# EAGLE design RTC-power (EAGLE 7.6.0)
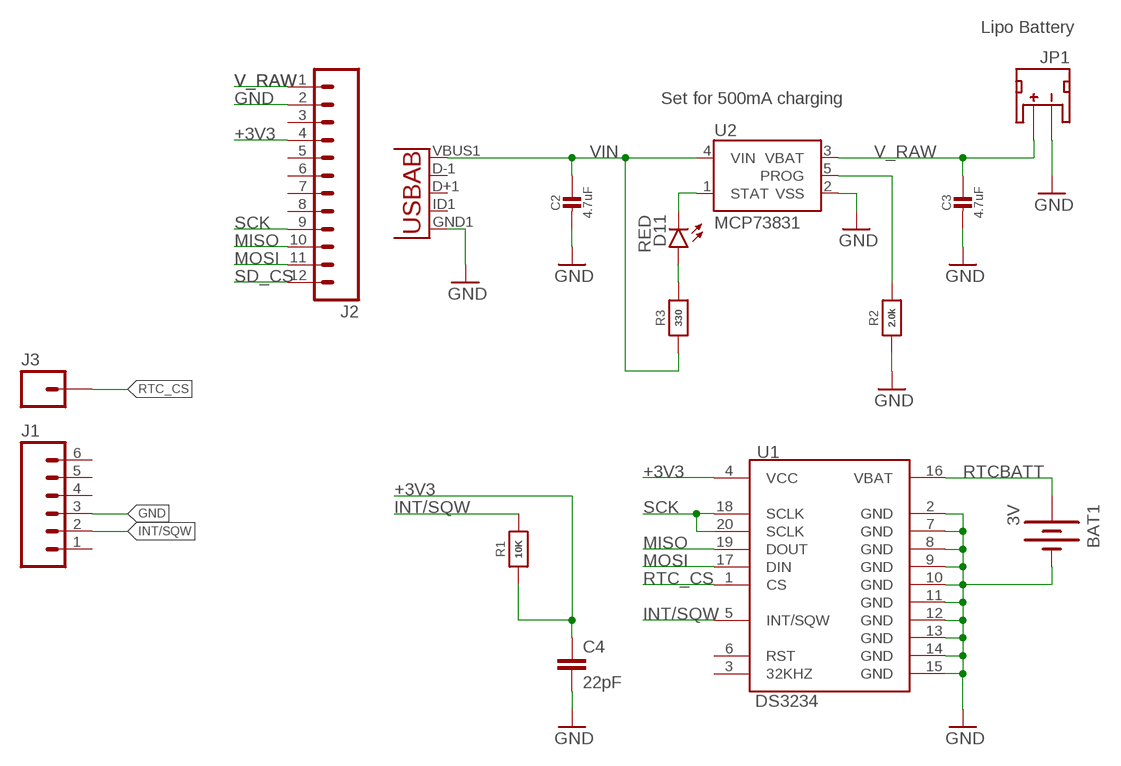
[diagram p0: schematic, sheet 1]

## Parts
BAT1  3V  BATTERY  [BATTCON_12MM_CURVED]
C2  4.7uF  CAP_CERAMIC0805-NOOUTLINE  [0805-NO]
C3  4.7uF  CAP_CERAMIC0805-NOOUTLINE  [0805-NO]
C4  22pF  CAP0402-CAP  [0402-CAP]
D11  RED  LED-RED0603  [LED-0603]
J1  M06SILK_FEMALE_PTH  [1X06]
J2  M12PTH  [1X12]
J3  M01PTH  [1X01]
JP1  JST  JST_2MM_MALE  [JST-2-SMD@1]
JP9  Micro USB  USB-ABCONN-11794  [USB-AB-MICRO-SMD_V03]
R1  10K  RESISTOR_0805MP  [_0805MP]
R2  2.0k  RESISTOR_0805MP  [_0805MP]
R3  330  RESISTOR_0805MP  [_0805MP]
U1  DS3234  [DS3234]
U2  MCP73831  [SOT23-5]

## Nets
+3V3: C4.1 J2.4 R1.1 U1.4(VCC)
GND: BAT1.GND(-) C2.2 C3.2 C4.2 J2.2 JP1.1(-) JP9.GND1(GND) R2.1 U1.2(GND) U1.7(GND) U1.8(GND) U1.9(GND) U1.10(GND) U1.11(GND) U1.12(GND) U1.13(GND) U1.14(GND) U1.15(GND) U2.2(VSS)
INT/SQW: R1.2 U1.5(INT/SQW)
MISO: J2.10 U1.19(DOUT)
MOSI: J2.11 U1.17(DIN)
N$3: D11.A R3.2
PROG: R2.2 U2.5(PROG)
RTC_CS: J3.1 U1.1(CS)
RTCBATT: BAT1.PWR@1(+) U1.16(VBAT)
SCK: J2.9 U1.18(SCLK) U1.20(SCLK)
SD_CS: J2.12
STAT: D11.C U2.1(STAT)
V_RAW: C3.1 J2.1 JP1.2(+) U2.3(VBAT)
VIN: C2.1 JP9.VBUS1(VBUS) R3.1 U2.4(VIN)
Unconnected: J1.1 J1.2 J1.3 J1.4 J1.5 J1.6 J2.3 J2.5 J2.6 J2.7 J2.8 JP1.NC1(PAD1) JP1.NC2(PAD2) JP9.D+1(D+) JP9.D-1(D-) JP9.ID1(USBID) U1.3(32KHZ) U1.6(RST)

## Notes on the sheet
- Lipo Battery
- Set for 500mA charging

## Library data of the parts
BAT1 = SparkFun:BATTERY: Battery Holders Various common sizes : AA, AAA, 20mm coin cell and 12mm coin cell.
C2 C3 = microbuilder:CAP_CERAMIC: Ceramic Capacitors For new designs, use the packages preceded by an '_' character since they are more reliable: The following footprints should be used on most boards: _0402 - Standard footprint for regular board layouts _0603 - Standard footprint for regular board layouts _0805 - Standard footprint for regular board layouts _1206 - Standard footprint for regular board layouts For extremely tight-pitch boards where space is at a premium, the following 'micro-pitch' footprints can be used (smaller pads, no silkscreen outline, etc.): _0402MP - Micro-pitch footprint for very dense/compact boards _0603MP - Micro-pitch footprint for very dense/compact boards _0805MP - Micro-pitch footprint for very dense/compact boards _1206MP - Micro-pitch footprint for very dense/compact boards
C4 = SparkFun:CAP: Capacitor Standard 0603 ceramic capacitor, and 0.1" leaded capacitor.
D11 = SparkFun-LED:LED-RED: Assorted Red LEDs LilyPad 1206- DIO-09912 1206- DIO-00809 0603- DIO-00819; PROD_ID: DIO-00819
J1 = SparkFun-Connectors:M06: Header 6 Standard 6-pin 0.1" header. Use with straight break away headers (SKU : PRT-00116), right angle break away headers (PRT-00553), swiss pins (PRT-00743), machine pins (PRT-00117), and female headers (PRT-00115). Molex polarized connector foot print use with SKU : PRT-08094 with associated crimp pins and housings. NOTES ON THE VARIANTS LOCK and LOCK_LONGPADS... This footprint was designed to help hold the alignment of a through-hole component (i.e. 6-pin header) while soldering it into place. You may notice that each hole has been shifted either up or down by 0.005 of an inch from it's more standard position (which is a perfectly straight line). This slight alteration caused the pins (the squares in the middle) to touch the edges of the holes. Because they are alternating, it causes a "brace" to hold the component in place. 0.005 has proven to be the perfect amount of "off-center" position when using our standard breakaway headers. Although looks a little odd when you look at the bare footprint, once you have a header in there, the alteration is very hard to notice. Also,if you push a header all the way into place, it is covered up entirely on the bottom side. This idea of altering the position of holes to aid alignment will be further integrated into the Sparkfun Library for other footprints. It can help hold any component with 3 or more connection pins.; PROD_ID: CONN-08437
J2 = SparkFun-Connectors:M12: Header 12 Standard 12-pin 0.1" header. Use with straight break away headers (SKU : PRT-00116), right angle break away headers (PRT-00553), swiss pins (PRT-00743), machine pins (PRT-00117), and female headers (PRT-00115).
J3 = SparkFun-Connectors:M01: Header 1 Standard 1-pin 0.1" header. Use with straight break away headers (SKU : PRT-00116), right angle break away headers (PRT-00553), swiss pins (PRT-00743), machine pins (PRT-00117), and female headers (PRT-00115). SMTSO-256-ET is a "flush mount" nut for a 4-40 screw. The older package used to be too tight, and did not allow it to sit properly thru the drill hit. The latest (0.165DIA) fits nice and snug.
JP1 = SparkFun-Connectors:JST_2MM_MALE: Mates to single-cell LiPo batteries. CONN-08352; PROD_ID: CONN-08352
JP9 = SparkFun-Connectors:USB-AB: This is a USB AB connector that is compatible with USB OTG. i.e. this connector can serve as a host or device; PROD_ID: CONN-11794
R1-R3 = microbuilder:RESISTOR: Resistors For new designs, use the packages preceded by an '_' character since they are more reliable: The following footprints should be used on most boards: _0402 - Standard footprint for regular board layouts _0603 - Standard footprint for regular board layouts _0805 - Standard footprint for regular board layouts _1206 - Standard footprint for regular board layouts For extremely tight-pitch boards where space is at a premium, the following 'micro-pitch' footprints can be used (smaller pads, no silkscreen outline, etc.): _0402MP - Micro-pitch footprint for very dense/compact boards _0603MP - Micro-pitch footprint for very dense/compact boards _0805MP - Micro-pitch footprint for very dense/compact boards _1206MP - Micro-pitch footprint for very dense/compact boards
U1 = SparkFun:DS3234: DS3234 Real Time Clock
U2 = SparkFun-PowerIC:MCP73831: Miniature single cell, fully integrated Li-Ion, Li-polymer charge management controller http://ww1.microchip.com/downloads/en/DeviceDoc/21984a.pdf IC-09995; PROD_ID: IC-09995

## Board
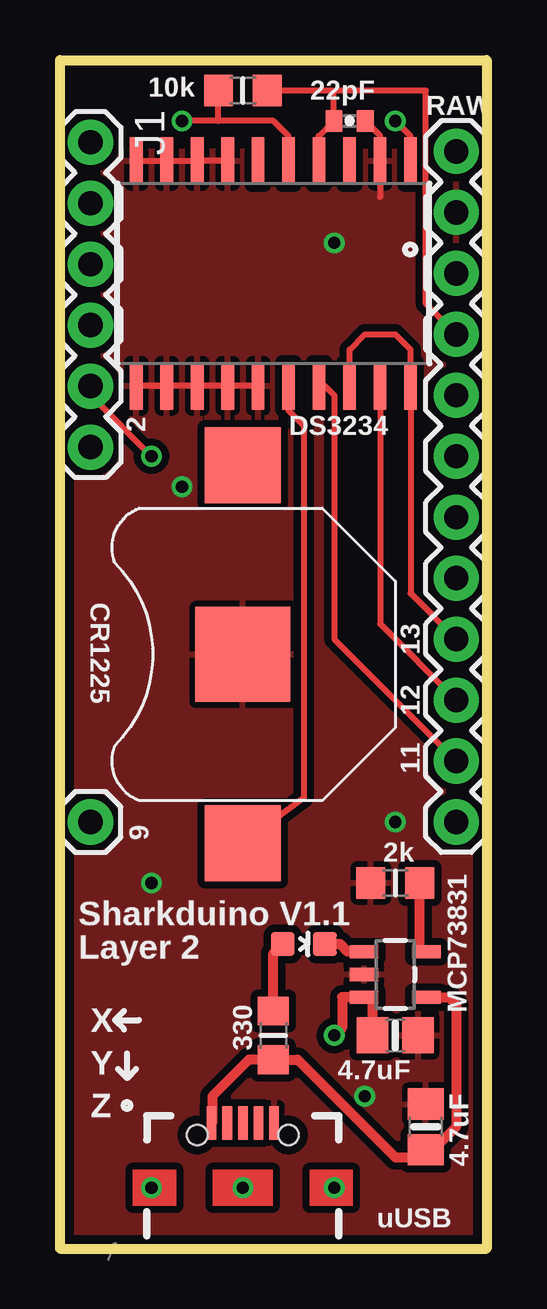
[diagram p1: board, top side]
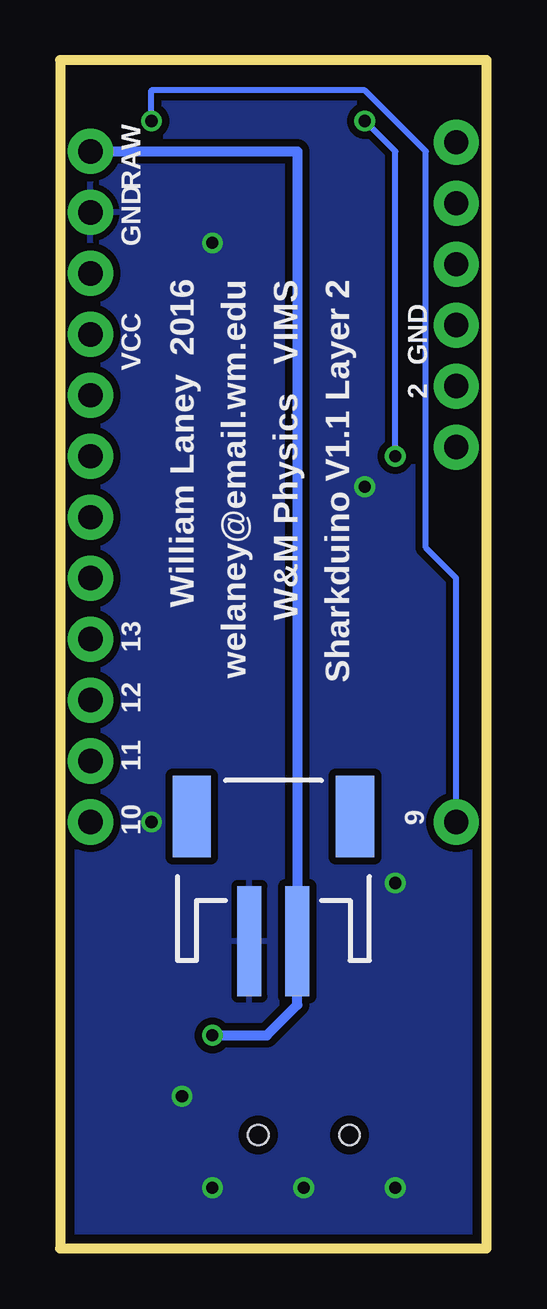
[diagram p2: board, bottom side, seen from below]

Size 17.78 x 49.53 mm. Coordinates in mm from the lower left corner, seen from the top.
Outline: 0,0 0,49.53 17.78,49.53 17.78,0 0,0
Copper layers (1*16): Top 0.0356mm / dielectric 1.5011mm / Bottom 0.0356mm
Design rules "oshpark-2layer": minimum track width 6mil, minimum drill 13mil, track to track 6mil, track to pad 6mil, pad to pad 6mil, via to via 6mil, smd to smd 6mil, copper to edge 15mil, drill to drill 6mil, minimum pad ring 7mil, minimum via ring 7mil, stop-mask expansion 2.5mil, vias tented up to drill 0mil, thermal gap 10mil

### Footprints (pad centres in the part's own frame; a part is rotated, then mirrored left to right if it is on the bottom)
BATTCON_12MM_CURVED = smd 3.962 x 3.962: GND 0,0 | smd 3.175 x 3.175: PWR@1 -7.874,0; PWR@2 7.874,0
0805-NO = smd 1.3 x 1.5: 1 -0.95,0; 2 0.95,0
0402-CAP = smd 0.7 x 0.9: 1 -0.65,0; 2 0.65,0
LED-0603 = smd 1 x 1: A 0,-0.877; C 0,0.877
1X06 = drill 1.016 pad 1.88: 1 0,0; 2 2.54,0; 3 5.08,0; 4 7.62,0; 5 10.16,0; 6 12.7,0
1X12 = drill 1.016 pad 1.88: 1 0,0; 2 2.54,0; 3 5.08,0; 4 7.62,0; 5 10.16,0; 6 12.7,0; 7 15.24,0; 8 17.78,0; 9 20.32,0; 10 22.86,0; 11 25.4,0; 12 27.94,0
1X01 = drill 1.016 pad 1.88: 1 0,0
JST-2-SMD@1 = smd 1 x 4.6: 1 -1,-3.7; 2 1,-3.7 | smd 1.6 x 3.4: NC1 -3.4,1.5; NC2 3.4,1.5
USB-AB-MICRO-SMD_V03 = smd 1.4 x 0.4: D+1 2.7,0; D-1 2.7,0.65; GND1 2.7,-1.3; ID1 2.7,-0.65; VBUS1 2.7,1.3 | hole 0.85: 2.2,1.9; 2.2,-1.9
_0805MP = smd 1.2 x 1.3: 1 -1.016,0; 2 1.016,0
DS3234 = smd 0.53 x 1.98: 1 -5.715,-4.685; 2 -4.445,-4.685; 3 -3.175,-4.685; 4 -1.905,-4.685; 5 -0.635,-4.685; 6 0.635,-4.685; 7 1.905,-4.685; 8 3.175,-4.685; 9 4.445,-4.685; 10 5.715,-4.685; 11 5.715,4.685; 12 4.445,4.685; 13 3.175,4.685; 14 1.905,4.685; 15 0.635,4.685; 16 -0.635,4.685; 17 -1.905,4.685; 18 -3.175,4.685; 19 -4.445,4.685; 20 -5.715,4.685
SOT23-5 = smd 0.55 x 1.2: 1 -0.95,-1.3; 2 0,-1.3; 3 0.95,-1.3; 4 0.95,1.3; 5 -0.95,1.3

### Placement (x,y rotation side)
BAT1  7.62,24.77 90 top
C2  15.24,5.08 90 top
C3  13.97,8.89 0 top
C4  12.06,46.99 0 top
D11  10.16,12.7 270 top
J1  1.27,46.1 270 top
J2  16.51,45.72 270 top
J3  1.27,17.78 0 top
JP1  8.89,16.51 0 bottom
JP9  7.62,2.54 90 top
R1  7.62,48.26 180 top
R2  13.97,15.24 0 top
R3  8.89,8.89 90 top
U1  8.89,40.64 180 top
U2  13.97,11.43 270 top

### Tracks (layer width: path | path; a pad name or v marks a point on that pad's centre or on a via)
+3V3
  Top 0.254: R1.1 11.43,48.26 | 11.43,48.26 15.24,48.26 15.24,39.37 J2.4 | U1.4 10.78,46.35 C4.1 11.41,48.24 11.43,48.26
GND  (via drill 0.51)
  Top 0.254: U1.10 U1.9 U1.8 U1.7 | U1.15 U1.14 U1.13 U1.12 | 3.81,35.95 U1.12 | U1.12 U1.11 | 13.34,43.81 U1.2 13.34,46.37 C4.2
  Top 0.406: C3.2 14.92,8.57
  other vias: 5.08,31.75 11.43,41.91 3.81,15.24 13.97,17.78 12.7,6.35 3.81,2.54 7.62,2.54 11.43,2.54
  pour Bottom (isolate 0.305): 0,49.53 0,0 17.78,0 17.78,49.53
  pour Top (isolate 0.305): 0,45.72 17.78,45.72 17.78,0 0,0
INT/SQW  (via drill 0.51)
  Top 0.254: U1.5 9.53,46.35 8.89,46.99 6.6,46.99 | 6.6,46.99 R1.2 | 6.6,46.99 v5.08,46.99 | 1.4,35.56 1.4,35.43 v3.81,33.02
  Bottom 0.254: v5.08,46.99 3.81,45.72 v3.81,33.02
MISO
  Top 0.254: U1.19 13.34,26.04 J2.10
MOSI
  Top 0.254: J2.11 11.43,25.4 11.43,35.56 11.04,35.95 U1.17
N$3
  Top 0.406: R3.2 8.89,12.31 D11.A
PROG
  Top 0.254: U2.5 14.99,12.38
  Top 0.406: 14.99,12.38 R2.2
RTC_CS  (via drill 0.51)
  Top 0.254: U1.1 14.61,46.35 v13.97,46.99
  Bottom 0.254: v13.97,46.99 13.97,48.26 5.08,48.26 2.54,45.72 2.54,29.21 1.27,27.94 J3.1
RTCBATT
  Top 0.254: U1.16 9.53,34.92 10.16,34.29 10.16,18.8 BAT1.PWR@1
SCK
  Top 0.254: U1.18 12.06,37.47 12.7,38.1 13.97,38.1 14.61,37.47 U1.20 14.61,27.3 J2.9
STAT
  Top 0.406: U2.1 11.99,12.38 11.67,12.7 D11.C
V_RAW  (via drill 0.51)
  Top 0.254: U2.3 13.02,10.48
  Top 0.406: 13.02,10.48 C3.1 | U2.3 11.75,10.48 11.75,9.21 v11.43,8.89
  Bottom 0.254: 7.89,11.43 JP1.2
  Bottom 0.406: v11.43,8.89 9.16,8.89 7.89,10.16 7.89,11.43 7.89,45.72 J2.1
VIN
  Top 0.254: 6.35,5.27 JP9.VBUS1
  Top 0.406: 6.35,5.27 6.35,6.35 7.87,7.87 R3.1 9.91,7.87 13.97,3.81 14.92,3.81 C2.1 15.56,4.13 16.51,5.08 16.51,10.16 16.19,10.48 U2.4

### Text on the board
tPlace: 10k | 22pF | RAW | 2 | DS3234 | CR1225 | 13 | 12 | 11 | 9 | 2k | MCP73831 | Sharkduino V1.1 | Layer 2 | X | 330 | 4.7uF | Y | Z | 4.7uF | uUSB
bPlace: RAW | GND | Sharkduino V1.1 Layer 2 | W&M Physics VIMS | welaney@email.wm.edu | William Laney 2016 | GND | VCC | 2 | 13 | 12 | 11 | 10 | 9